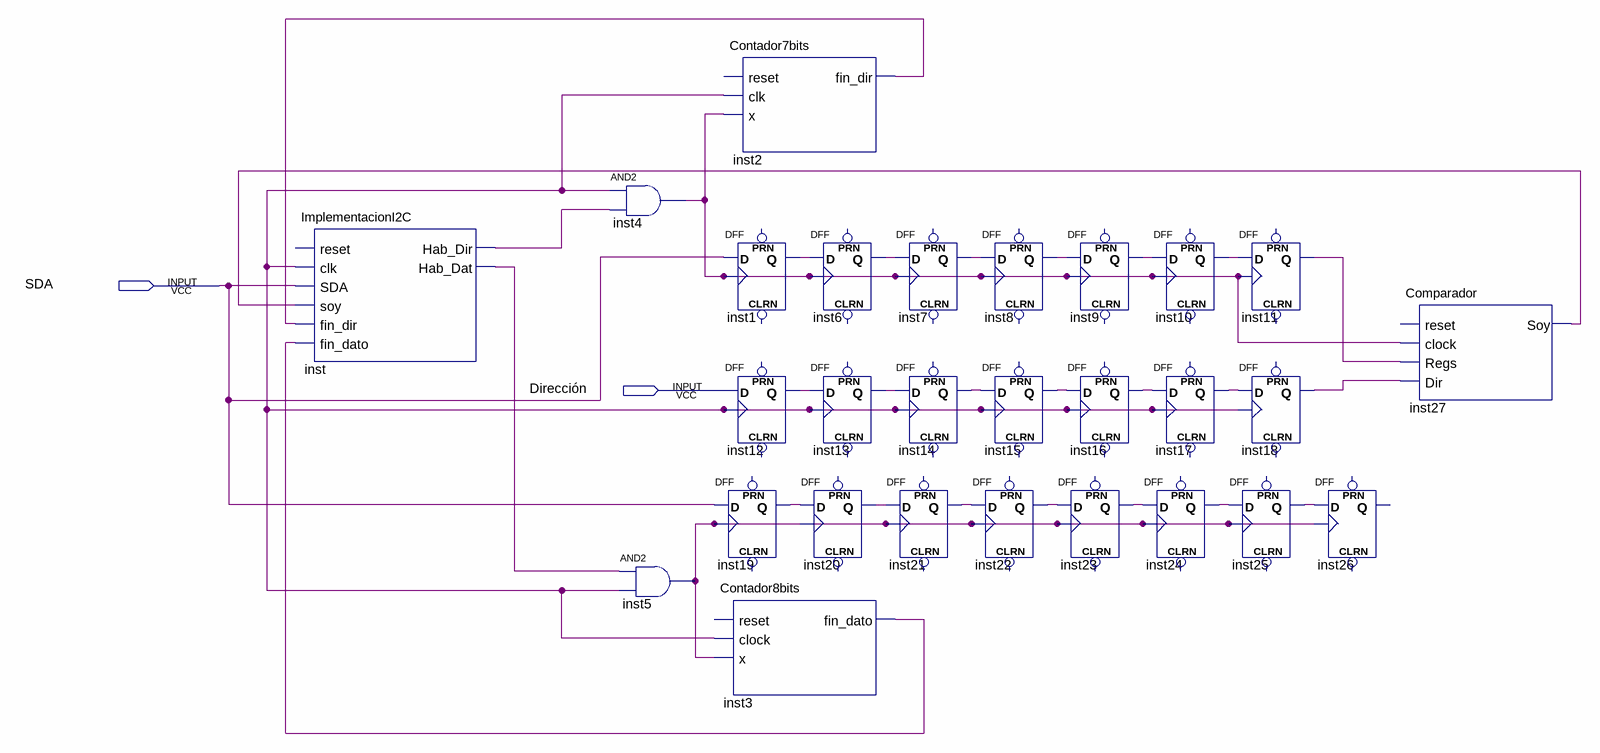
[diagram p0: schematic sheet]
// Quartus schematic Block1.bdf as structural Verilog: 28 symbols, 2 pins
module Block1 (
  input  SDA,
  input  \Dirección 
);

  wire inst1_q, inst2_fin_dir, inst3_fin_dato, inst4_out, inst5_out, inst6_q, inst7_q, inst8_q, inst9_q,
       inst10_q, inst11_q, inst12_q, inst13_q, inst14_q, inst15_q, inst16_q, inst17_q, inst18_q, inst19_q,
       inst20_q, inst21_q, inst22_q, inst23_q, inst24_q, inst25_q, inst27_soy, inst_hab_dat, inst_hab_dir,
       undriven;

  ImplementacionI2C inst (
    .clk(undriven), .SDA(SDA), .soy(inst27_soy), .fin_dir(inst2_fin_dir), .fin_dato(inst3_fin_dato),
    .Hab_Dir(inst_hab_dir), .Hab_Dat(inst_hab_dat));  // open: reset
  and inst4 (inst4_out, undriven, inst_hab_dir);
  and inst5 (inst5_out, inst_hab_dat, undriven);
  Contador7bits inst2 (.clk(undriven), .x(inst4_out), .fin_dir(inst2_fin_dir));  // open: reset
  DFF inst1 (.CLK(inst4_out), .D(SDA), .Q(inst1_q));  // open: CLRN, PRN
  DFF inst12 (.CLK(undriven), .D(\Dirección ), .Q(inst12_q));  // open: CLRN, PRN
  DFF inst19 (.CLK(inst5_out), .D(SDA), .Q(inst19_q));  // open: CLRN, PRN
  Contador8bits inst3 (.clock(undriven), .x(inst5_out), .fin_dato(inst3_fin_dato));  // open: reset
  DFF inst6 (.CLK(inst4_out), .D(inst1_q), .Q(inst6_q));  // open: CLRN, PRN
  DFF inst13 (.CLK(undriven), .D(inst12_q), .Q(inst13_q));  // open: CLRN, PRN
  DFF inst20 (.CLK(inst5_out), .D(inst19_q), .Q(inst20_q));  // open: CLRN, PRN
  DFF inst21 (.CLK(inst5_out), .D(inst20_q), .Q(inst21_q));  // open: CLRN, PRN
  DFF inst7 (.CLK(inst4_out), .D(inst6_q), .Q(inst7_q));  // open: CLRN, PRN
  DFF inst14 (.CLK(undriven), .D(inst13_q), .Q(inst14_q));  // open: CLRN, PRN
  DFF inst8 (.CLK(inst4_out), .D(inst7_q), .Q(inst8_q));  // open: CLRN, PRN
  DFF inst15 (.CLK(undriven), .D(inst14_q), .Q(inst15_q));  // open: CLRN, PRN
  DFF inst22 (.CLK(inst5_out), .D(inst21_q), .Q(inst22_q));  // open: CLRN, PRN
  DFF inst9 (.CLK(inst4_out), .D(inst8_q), .Q(inst9_q));  // open: CLRN, PRN
  DFF inst16 (.CLK(undriven), .D(inst15_q), .Q(inst16_q));  // open: CLRN, PRN
  DFF inst23 (.CLK(inst5_out), .D(inst22_q), .Q(inst23_q));  // open: CLRN, PRN
  DFF inst10 (.CLK(inst4_out), .D(inst9_q), .Q(inst10_q));  // open: CLRN, PRN
  DFF inst17 (.CLK(undriven), .D(inst16_q), .Q(inst17_q));  // open: CLRN, PRN
  DFF inst24 (.CLK(inst5_out), .D(inst23_q), .Q(inst24_q));  // open: CLRN, PRN
  DFF inst11 (.CLK(inst4_out), .D(inst10_q), .Q(inst11_q));  // open: CLRN, PRN
  DFF inst18 (.CLK(undriven), .D(inst17_q), .Q(inst18_q));  // open: CLRN, PRN
  DFF inst25 (.CLK(inst5_out), .D(inst24_q), .Q(inst25_q));  // open: CLRN, PRN
  DFF inst26 (.CLK(inst5_out), .D(inst25_q));  // open: CLRN, PRN, Q
  Comparador inst27 (.clock(inst4_out), .Regs(inst11_q), .Dir(inst18_q), .Soy(inst27_soy));  // open: reset
endmodule
